# Altium schematic sheet Sheet1.SchDoc
size A1
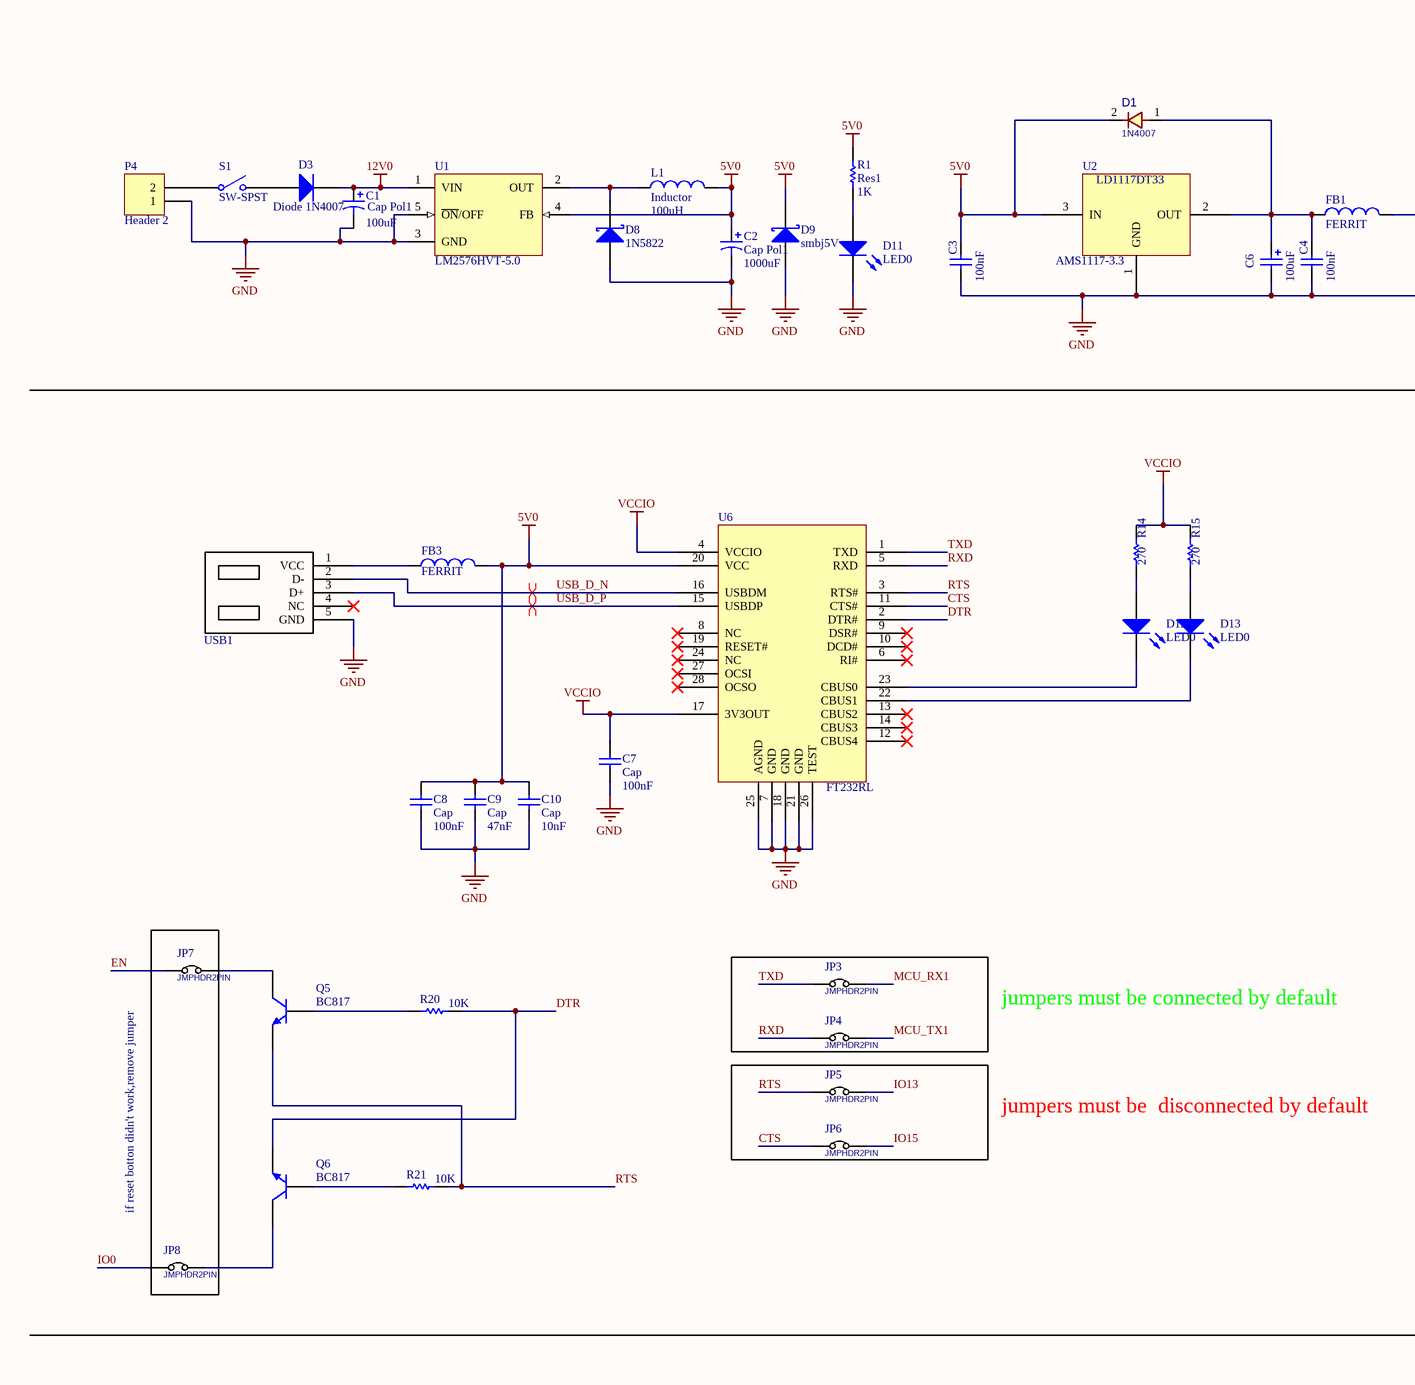
[diagram p0: Sheet1.SchDoc, top left]
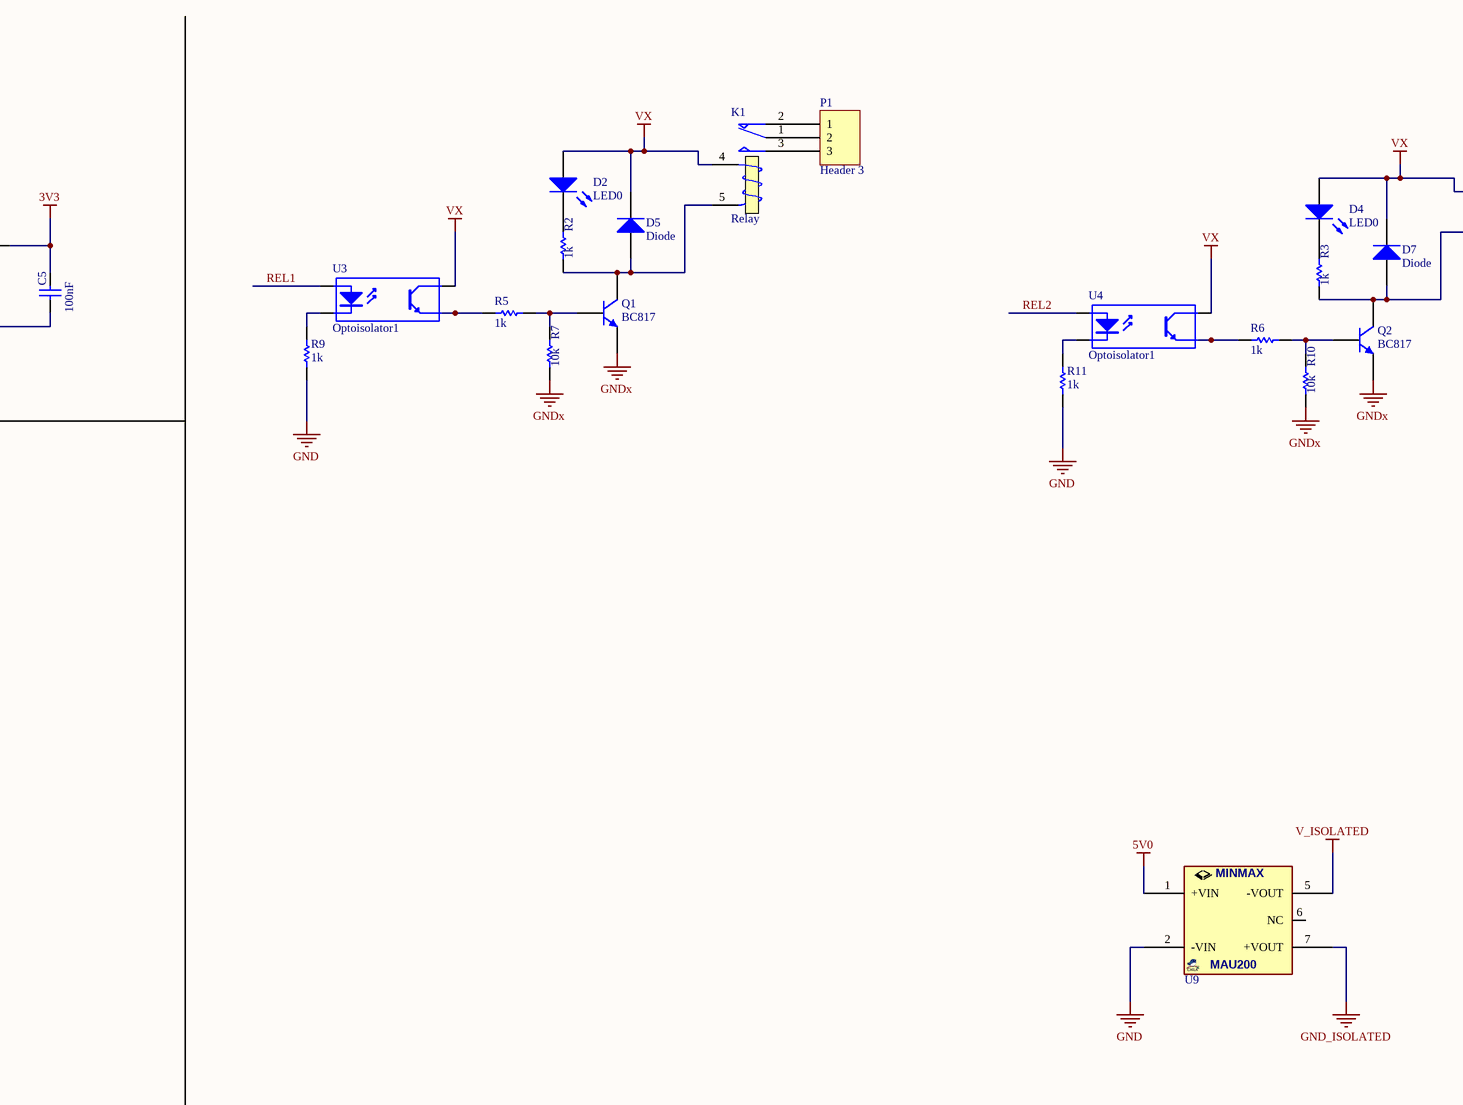
[diagram p1: Sheet1.SchDoc, top middle]
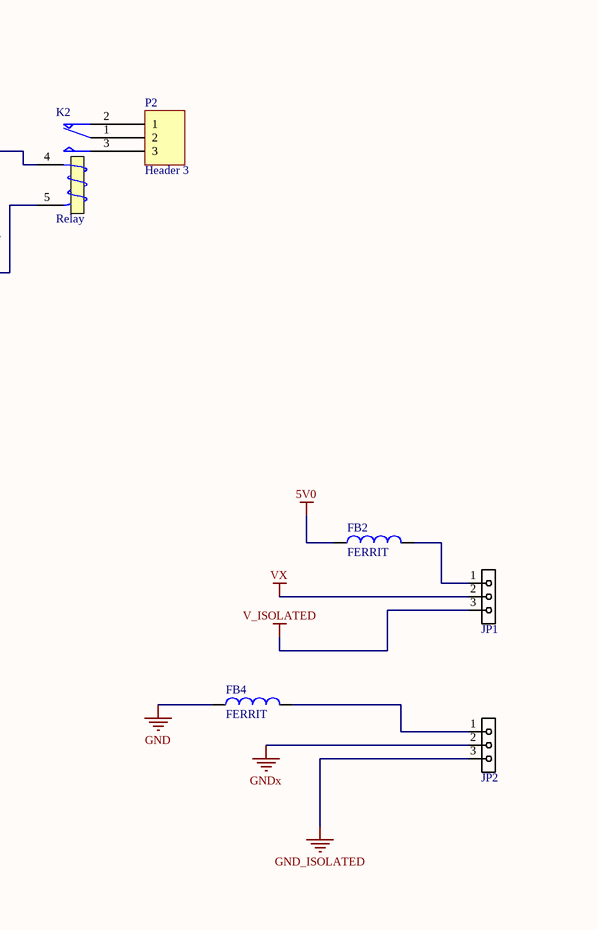
[diagram p2: Sheet1.SchDoc, top right]
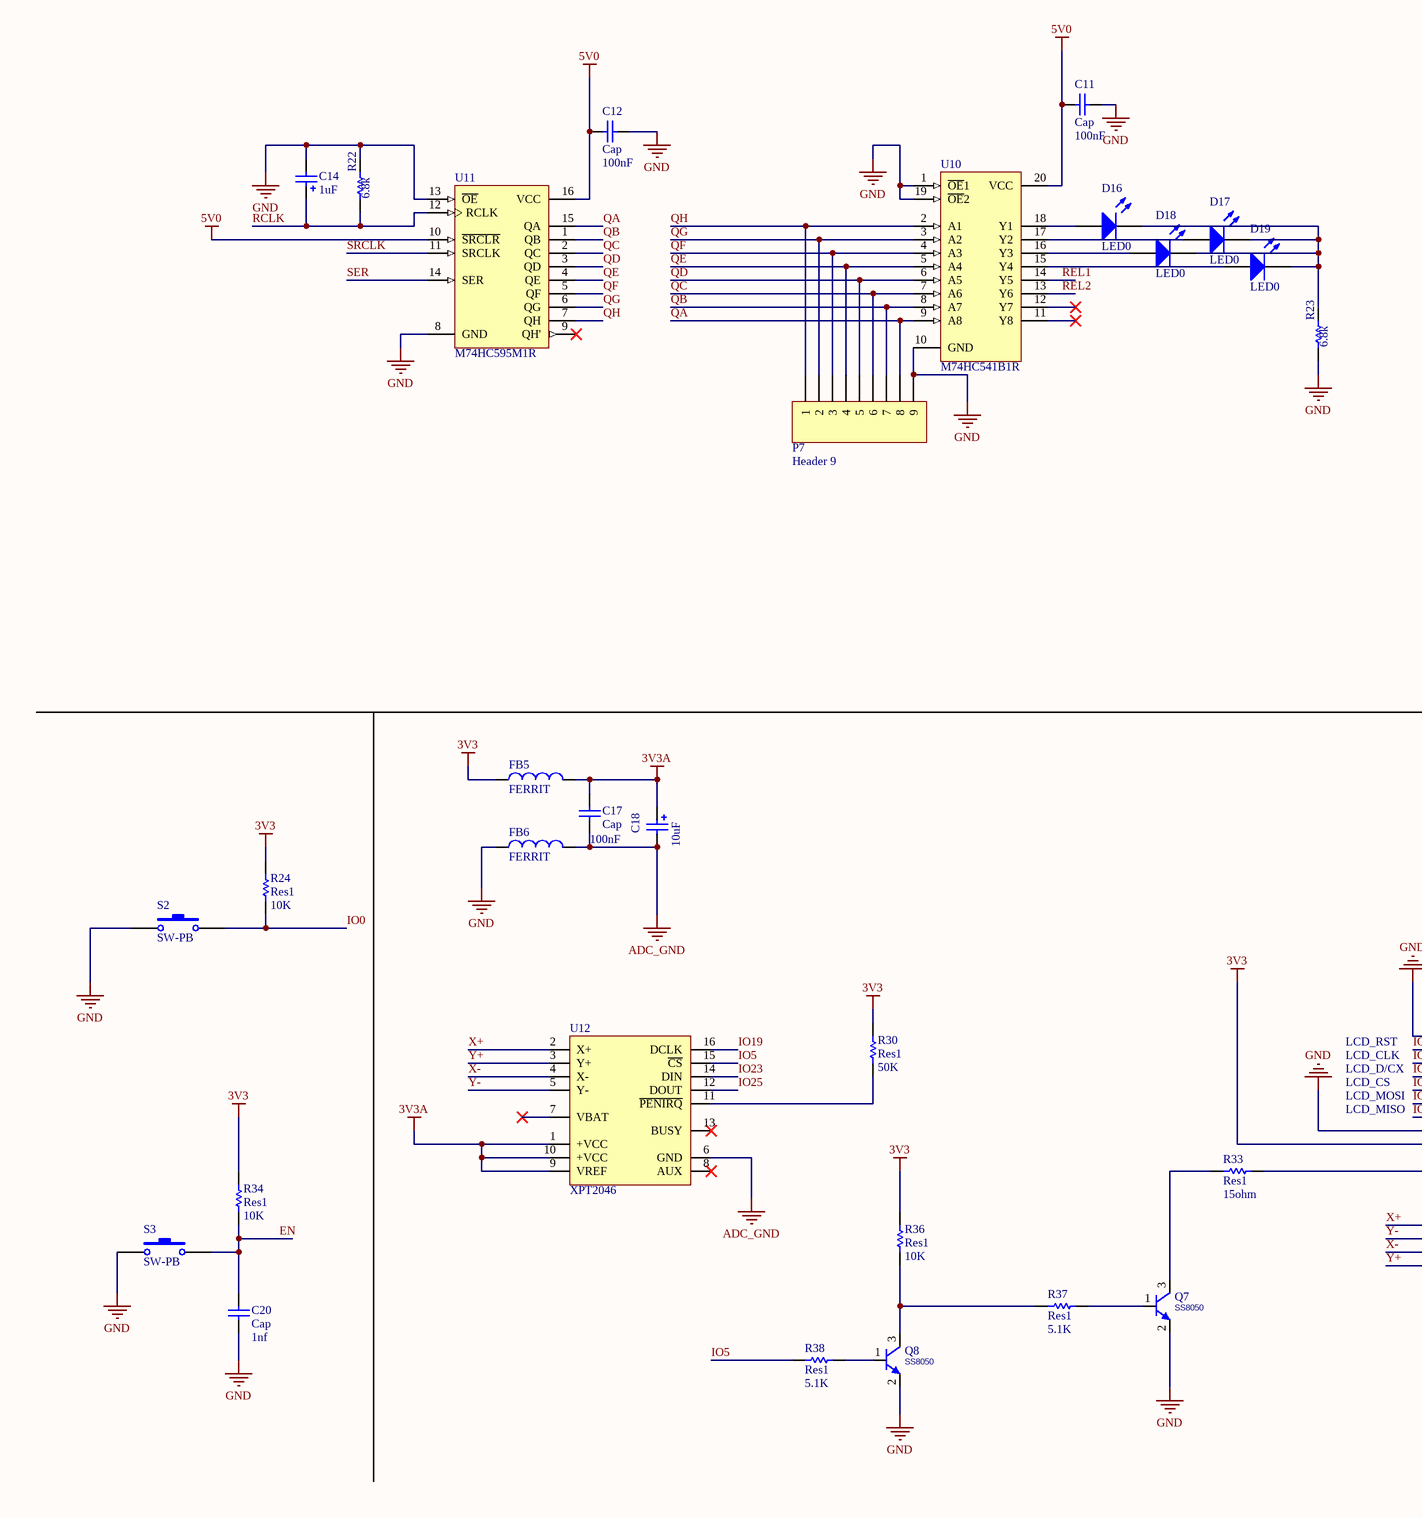
[diagram p3: Sheet1.SchDoc, bottom left]
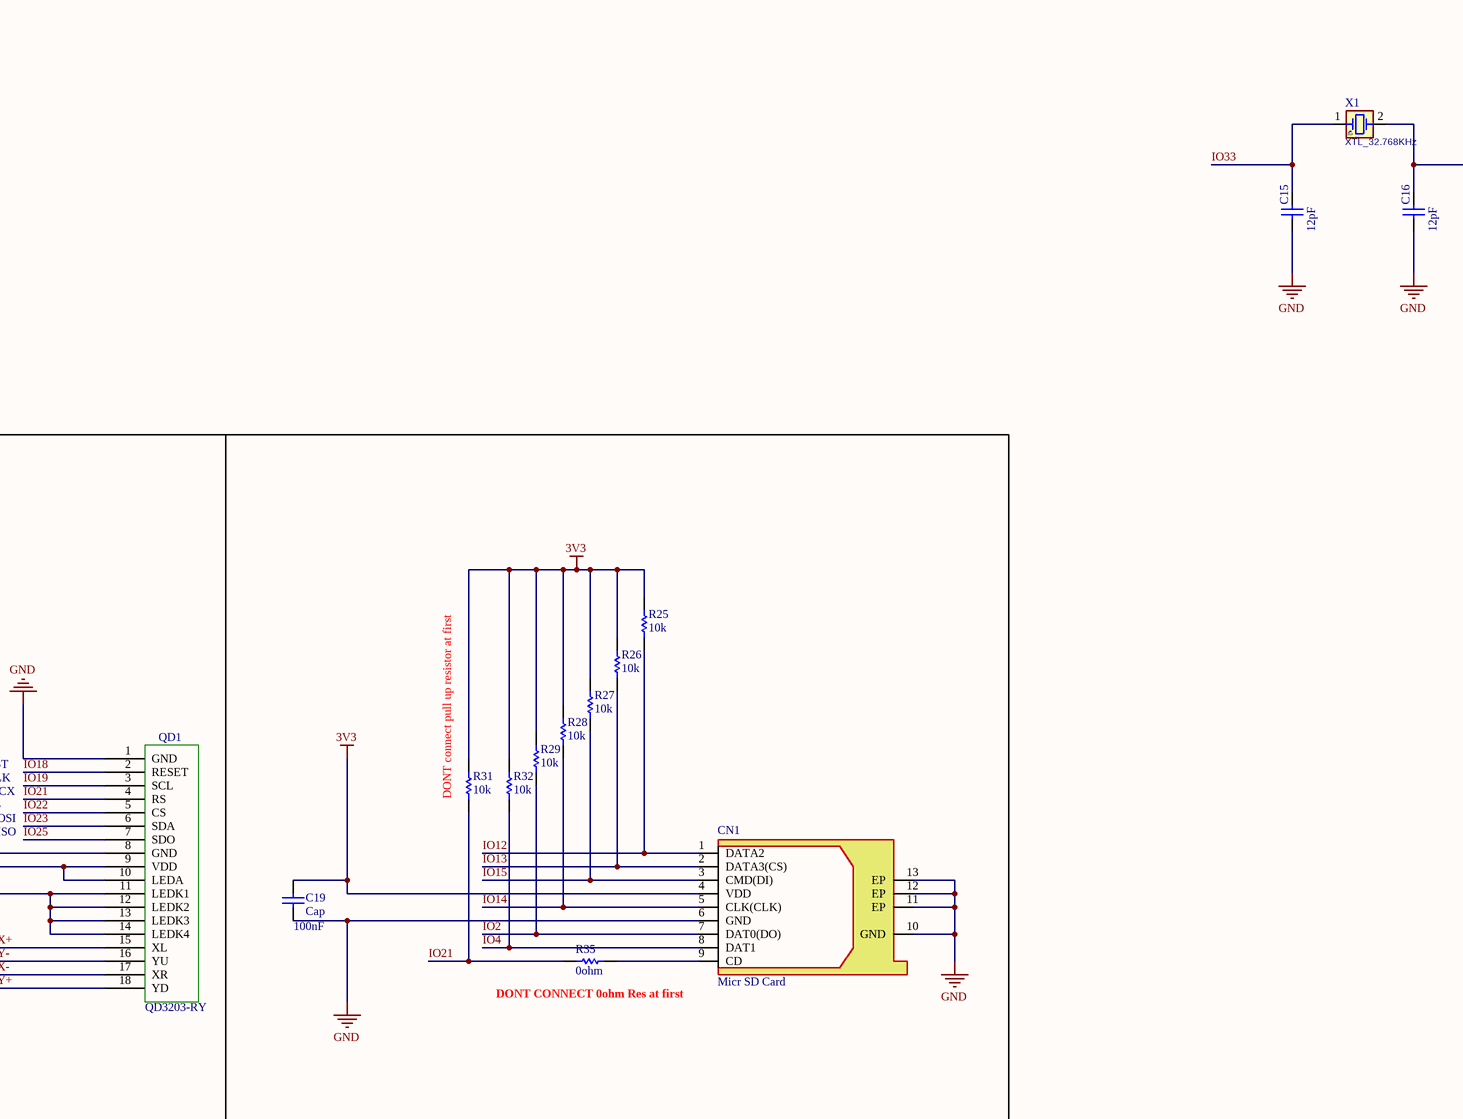
[diagram p4: Sheet1.SchDoc, bottom middle]
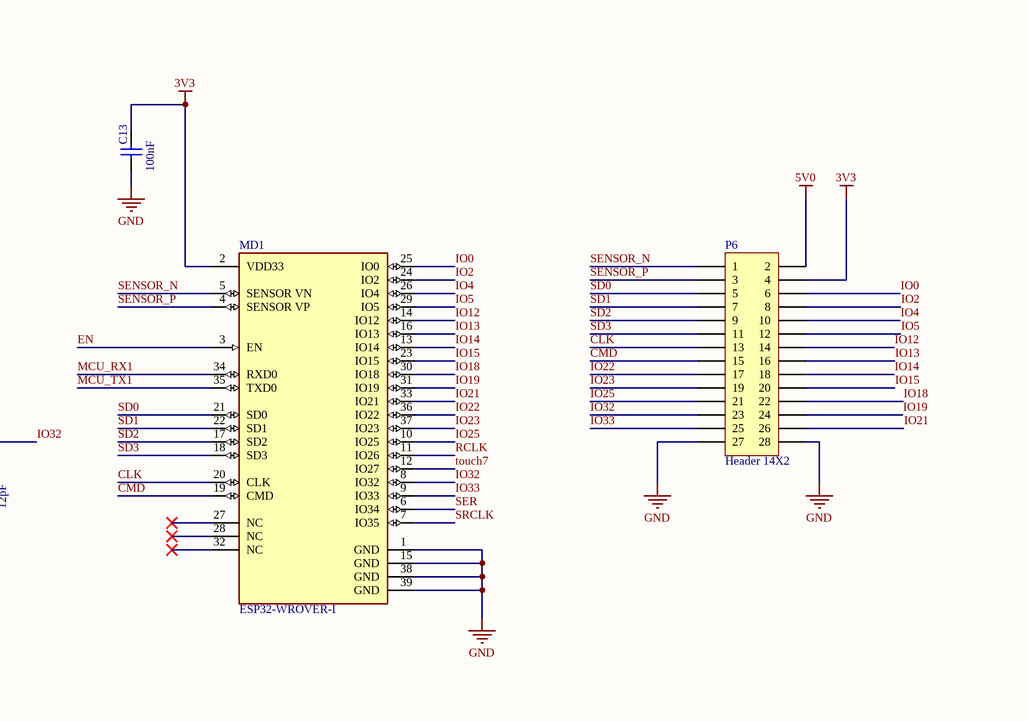
[diagram p5: Sheet1.SchDoc, bottom right]

## Parts
C1  Cap Pol1  value 100uF  [C_CYL_SMD2]
C2  Cap Pol1  value 1000uF  [C_CYL_SMD]
C3  value 100nF  [SMD_805]  (hidden comment: Cap)
C4  value 100nF  [SMD_805]  (hidden comment: Cap)
C5  value 100nF  [SMD_805]  (hidden comment: Cap)
C6  value 100uF  [C_B]  (hidden comment: Cap Pol2)
C7  Cap  value 100nF  [SMD_805]
C8  Cap  value 100nF  [SMD_805]
C9  Cap  value 47nF  [SMD_805]
C10  Cap  value 10nF  [SMD_805]
C11  Cap  value 100nF  [SMD_805]
C12  Cap  value 100nF  [SMD_805]
C13  value 100nF  [SMD_805]  (hidden comment: Cap)
C14  value 1uF  [CAP_SMD_A]  (hidden comment: Cap Pol2)
C15  value 12pF  [SMD_805]  (hidden comment: Cap)
C16  value 12pF  [SMD_805]  (hidden comment: Cap)
C17  Cap  value 100nF  [SMD_805]
C18  value 10uF  [C_B]  (hidden comment: Cap Pol2)
C19  Cap  value 100nF  [SMD_805]
C20  Cap  value 1nf  [SMD_805]
CN1  Micr SD Card  [Micro SD Card]
D1  1N4007  [D_SMA]
D2  LED0  [SMD_805]
D3  Diode 1N4007  [TVS]
D4  LED0  [SMD_805]
D5  Diode  [TVS]
D7  Diode  [TVS]
D8  1N5822  [DO_214_AB_SMC]
D9  smbj5V  [DO_214_AB_SMC]
D11  LED0  [SMD_805]
D12  LED0  [SMD_805]
D13  LED0  [SMD_805]
D16  LED0  [SMD_805]
D17  LED0  [SMD_805]
D18  LED0  [SMD_805]
D19  LED0  [SMD_805]
FB1  FERRIT  [SMD_805]
FB2  FERRIT  [SMD_805]
FB3  FERRIT  [SMD_805]
FB4  FERRIT  [SMD_805]
FB5  FERRIT  [SMD_805]
FB6  FERRIT  [SMD_805]
JP1  JMPHDR3PIN  [JP_3]  (value not drawn)
JP2  JMPHDR3PIN  [JP_3]  (value not drawn)
JP3  JMPHDR2PIN  [JP_2_BLK]
JP4  JMPHDR2PIN  [JP_2_BLK]
JP5  JMPHDR2PIN  [JP_2_BLK]
JP6  JMPHDR2PIN  [JP_2_BLK]
JP7  JMPHDR2PIN  [JP_2_BLK]
JP8  JMPHDR2PIN  [JP_2_BLK]
K1  Relay  [RELAY_5V]
K2  Relay  [RELAY_5V]
L1  Inductor  value 100uH  [INDUC_SMD]
MD1  ESP32-WROVER-I  [FP-ESP32-WROVER-I-MFG]
P1  Header 3  [PHOENIX_3]
P2  Header 3  [PHOENIX_3]
P4  Header 2  [adap_jack]
P6  Header 14X2  [HDR2X14]
P7  Header 9  [ARAY 9]
Q1  BC817  [SOT23]
Q2  BC817  [SOT23]
Q5  BC817  [SOT23]
Q6  BC817  [SOT23]
Q7  SS8050  [SOT23_3]
Q8  SS8050  [SOT23_3]
QD1  QD3203-RY  [QD-TFT2803]
R1  Res1  value 1K  [SMD_805]
R2  value 1k  [SMD_805]  (hidden comment: Res1)
R3  value 1k  [SMD_805]  (hidden comment: Res1)
R5  value 1k  [SMD_805]  (hidden comment: Res1)
R6  value 1k  [SMD_805]  (hidden comment: Res1)
R7  value 10k  [SMD_805]  (hidden comment: Res1)
R9  value 1k  [SMD_805]  (hidden comment: Res1)
R10  value 10k  [SMD_805]  (hidden comment: Res1)
R11  value 1k  [SMD_805]  (hidden comment: Res1)
R14  value 270  [SMD_805]  (hidden comment: Res1)
R15  value 270  [SMD_805]  (hidden comment: Res1)
R20  value 10K  [SMD_805]  (hidden comment: Res1)
R21  value 10K  [SMD_805]  (hidden comment: Res1)
R22  value 6.8k  [SMD_805]  (hidden comment: Res1)
R23  value 6.8k  [SMD_805]  (hidden comment: Res1)
R24  Res1  value 10K  [SMD_805]
R25  value 10k  [SMD_805]  (hidden comment: Res1)
R26  value 10k  [SMD_805]  (hidden comment: Res1)
R27  value 10k  [SMD_805]  (hidden comment: Res1)
R28  value 10k  [SMD_805]  (hidden comment: Res1)
R29  value 10k  [SMD_805]  (hidden comment: Res1)
R30  Res1  value 50K  [SMD_805]
R31  value 10k  [SMD_805]  (hidden comment: Res1)
R32  value 10k  [SMD_805]  (hidden comment: Res1)
R33  Res1  value 15ohm  [SMD_805]
R34  Res1  value 10K  [SMD_805]
R35  value 0ohm  [SMD_805]  (hidden comment: Res1)
R36  Res1  value 10K  [SMD_805]
R37  Res1  value 5.1K  [SMD_805]
R38  Res1  value 5.1K  [SMD_805]
S1  SW-SPST  [KEY1]
S2  SW-PB  [smd_button]
S3  SW-PB  [smd_button]
U1  LM2576HVT-5.0  [TO - 263]
U2  AMS1117-3.3  [SOT223]
U3  Optoisolator1  [PC817_SMD]
U4  Optoisolator1  [PC817_SMD]
U6  FT232RL  [SOG65_28_W]
U9  MAU202  [MINMAX_MAU200]  (value not drawn)
U10  M74HC541B1R  [SOP20]
U11  M74HC595M1R  [SO16_L]
U12  XPT2046  [TSSOP-16]
USB1  MICRO_USB  [MINI_USB]  (value not drawn)
X1  XTL_32.768KHz  [XTL_2_1610]

## Nets
3V3: C5.2 C13.2 C19.2 CN1.4(VDD) FB1.2 FB5.1 MD1.2(VDD33) P6.4 QD1.9(VDD) QD1.10(LEDA) R24.2 R25.1 R26.1 R27.1 R28.1 R29.1 R30.2 R31.1 R32.1 R34.2 R36.2
3V3A: C17.2 C18.1 FB5.2 U12.1(+VCC) U12.9(VREF) U12.10(+VCC)
5V0: C2.1 C3.2 C8.2 C9.2 C10.2 C11.2 C12.1 D1.2 D9.2(K) FB2.1 FB3.2 L1.2 P6.2 R1.2 U1.4(FB) U2.3(IN) U6.20(VCC) U9.1(+VIN) U10.20(VCC) U11.10(~{SRCLR}) U11.16(VCC)
12V0: C1.1 D3.2(K) U1.1(VIN)
ADC_GND: C17.1 C18.2 FB6.2 U12.6(GND)
GND: C1.2 C2.2 C3.1 C4.1 C5.1 C6.2 C7.1 C8.1 C9.1 C10.1 C11.1 C12.2 C13.1 C14.2 C15.1 C16.1 C19.1 C20.1 CN1.6(GND) CN1.10(GND) CN1.11(EP) CN1.12(EP) CN1.13(EP) D8.1(A) D9.1(A) D11.2(K) FB4.1 FB6.1 MD1.1(GND) MD1.15(GND) MD1.38(GND) MD1.39(GND) P4.1 P6.27 P6.28 P7.9 Q7.2(E) Q8.2(E) QD1.1(GND) QD1.8(GND) R9.2 R11.2 R22.2 R23.1 S2.1 S3.1 U1.3(GND) U1.5(~{ON}/OFF) U2.1(GND) U6.7(GND) U6.18(GND) U6.21(GND) U6.25(AGND) U6.26(TEST) U9.2(-VIN) U10.1(~{OE}1) U10.10(GND) U10.19(~{OE}2) U11.8(GND) U11.13(~{OE}) USB1.5(GND)
GND_ISOLATED: JP2.3 U9.7(+VOUT)
GNDx: JP2.2 Q1.2(E) Q2.2(E) R7.1 R10.1
V_ISOLATED: JP1.3 U9.5(-VOUT)
VCCIO: C7.2 R14.2 R15.2 U6.4(VCCIO) U6.17(3V3OUT)
VX: D2.1(A) D4.1(A) D5.2(K) D7.2(K) JP1.2 K1.4(T1) K2.4(T1) U3.4(C) U4.4(C)
CLK: MD1.20(CLK) P6.13
CMD: MD1.19(CMD) P6.15
CTS: JP6.1 U6.11(CTS#)
DTR: Q6.2(E) R20.1 U6.2(DTR#)
EN: C20.2 JP7.1 MD1.3(EN) R34.1 S3.2
IO0: JP8.1 MD1.25(IO0) P6.6 R24.1 S2.2
IO2: CN1.7(DAT0(DO)) MD1.24(IO2) P6.8 R29.2
IO4: CN1.8(DAT1) MD1.26(IO4) P6.10 R32.2
IO5: MD1.29(IO5) P6.12 R38.2 U12.15(~{CS})
IO12: CN1.1(DATA2) MD1.14(IO12) P6.14 R25.2
IO13: CN1.2(DATA3(CS)) JP5.2 MD1.16(IO13) P6.16 R26.2
IO14: CN1.5(CLK(CLK)) MD1.13(IO14) P6.18 R28.2
IO15: CN1.3(CMD(DI)) JP6.2 MD1.23(IO15) P6.20 R27.2
IO18: MD1.30(IO18) P6.22 QD1.2(RESET)
IO19: MD1.31(IO19) P6.24 QD1.3(SCL) U12.16(DCLK)
IO21: MD1.33(IO21) P6.26 QD1.4(RS) R31.2 R35.1
IO22: MD1.36(IO22) P6.17 QD1.5(CS)
IO23: MD1.37(IO23) P6.19 QD1.6(SDA) U12.14(DIN)
IO25: MD1.10(IO25) P6.21 QD1.7(SDO) U12.12(DOUT)
IO32: C16.2 MD1.8(IO32) P6.23 X1.2(OSC2)
IO33: C15.2 MD1.9(IO33) P6.25 X1.1(OSC1)
MCU_RX1: JP3.2 MD1.34(RXD0)
MCU_TX1: JP4.2 MD1.35(TXD0)
QA: P7.8 U10.9(A8) U11.15(QA)
QB: P7.7 U10.8(A7) U11.1(QB)
QC: P7.6 U10.7(A6) U11.2(QC)
QD: P7.5 U10.6(A5) U11.3(QD)
QE: P7.4 U10.5(A4) U11.4(QE)
QF: P7.3 U10.4(A3) U11.5(QF)
QG: P7.2 U10.3(A2) U11.6(QG)
QH: P7.1 U10.2(A1) U11.7(QH)
RCLK: C14.1 MD1.11(IO26) R22.1 U11.12(RCLK)
REL1: U3.1(A) U10.14(Y5)
REL2: U4.1(A) U10.13(Y6)
RTS: JP5.1 Q5.2(E) R21.1 U6.3(RTS#)
RXD: JP4.1 U6.5(RXD)
SD0: MD1.21(SD0) P6.5
SD1: MD1.22(SD1) P6.7
SD2: MD1.17(SD2) P6.9
SD3: MD1.18(SD3) P6.11
SENSOR_N: MD1.5(SENSOR_VN) P6.1
SENSOR_P: MD1.4(SENSOR_VP) P6.3
SER: MD1.6(IO34) U11.14(SER)
SRCLK: MD1.7(IO35) U11.11(SRCLK)
touch7: MD1.12(IO27)
TXD: JP3.1 U6.1(TXD)
USB_D_N: U6.16(USBDM) USB1.2(D-)
USB_D_P: U6.15(USBDP) USB1.3(D+)
X+: QD1.15(XL) U12.2(X+)
X-: QD1.17(XR) U12.4(X-)
Y+: QD1.18(YD) U12.3(Y+)
Y-: QD1.16(YU) U12.5(Y-)
NetC4_2: C4.2 C6.1 D1.1 FB1.1 U2.2(OUT)
NetCN1_9: CN1.9(CD) R35.2
NetD2_2: D2.2(K) R2.2
NetD3_1: D3.1(A) S1.2(NO)
NetD4_2: D4.2(K) R3.2
NetD5_1: D5.1(A) K1.5(T2) Q1.3(C) R2.1
NetD7_1: D7.1(A) K2.5(T2) Q2.3(C) R3.1
NetD8_2: D8.2(K) L1.1 U1.2(OUT)
NetD11_1: D11.1(A) R1.1
NetD12_1: D12.1(A) R14.1
NetD12_2: D12.2(K) U6.23(CBUS0)
NetD13_1: D13.1(A) R15.1
NetD13_2: D13.2(K) U6.22(CBUS1)
NetD16_1: D16.1(A) U10.18(Y1)
NetD16_2: D16.2(K) D17.2(K) D18.2(K) D19.2(K) R23.2
NetD17_1: D17.1(A) U10.17(Y2)
NetD18_1: D18.1(A) U10.16(Y3)
NetD19_1: D19.1(A) U10.15(Y4)
NetFB2_2: FB2.2 JP1.1
NetFB3_1: FB3.1 USB1.1(VCC)
NetFB4_2: FB4.2 JP2.1
NetJP7_2: JP7.2 Q5.3(C)
NetJP8_2: JP8.2 Q6.3(C)
NetK1_1: K1.1(COM) P1.2
NetK1_2: K1.2(NC) P1.1
NetK1_3: K1.3(NO) P1.3
NetK2_1: K2.1(COM) P2.2
NetK2_2: K2.2(NC) P2.1
NetK2_3: K2.3(NO) P2.3
NetP4_2: P4.2 S1.1(COMMON)
NetQ1_1: Q1.1(B) R5.2 R7.2
NetQ2_1: Q2.1(B) R6.2 R10.2
NetQ5_1: Q5.1(B) R20.2
NetQ6_1: Q6.1(B) R21.2
NetQ7_1: Q7.1(B) R37.1
NetQ7_3: Q7.3(C) R33.2
NetQ8_1: Q8.1(B) R38.1
NetQ8_3: Q8.3(C) R36.1 R37.2
NetQD1_11: QD1.11(LEDK1) QD1.12(LEDK2) QD1.13(LEDK3) QD1.14(LEDK4) R33.1
NetR5_1: R5.1 U3.3(E)
NetR6_1: R6.1 U4.3(E)
NetR9_1: R9.1 U3.2(K)
NetR11_1: R11.1 U4.2(K)
NetR30_1: R30.1 U12.11(~{PENIRQ})

Not connected (* = marked no-connect by the designer): MD1 27(NC)* 28(NC)* 32(NC)*; U6 6(RI#)* 8(NC)* 9(DSR#)* 10(DCD#)* 12(CBUS4)* 13(CBUS2)* 14(CBUS3)* 19(RESET#)* 24(NC)* 27(OCSI)* 28(OCSO)*; U9 6(NC); U10 11(Y8)* 12(Y7)*; U11 9(QH')*; U12 7(VBAT)* 8(AUX)* 13(BUSY)*; USB1 4(NC)*

## Layout directives
differential pair: USB_D_N, USB_D_P

## Notes on the sheet
- jumpers must be connected by default
- jumpers must be  disconnected by default
- if reset botton didn't work,remove jumper
- LCD_RST
- LCD_CLK
- LCD_D/CX
- (near R31) DONT connect pull up resistor at first
- LCD_CS
- LCD_MOSI
- LCD_MISO
- (near R35) DONT CONNECT 0ohm Res at first
- Title
- Size:
- Date:
- File:
- A1
- Number:
- Time:
- Revision:
- Sheet
- of
- (in symbol MAU202) MAU200

## Library data of the parts
C1 C2 = Cap Pol1: Polarized Capacitor (Radial); Published: 8-Jun-2000; LatestRevisionDate: 17-Jul-2002; LatestRevisionNote: Re-released for DXP Platform.; PackageReference: RB7.6-15; Publisher: Altium Limited
C3-C5 C7-C13 C15-C17 C19 C20 = Cap: Capacitor; Published: 8-Jun-2000; LatestRevisionDate: 17-Jul-2002; LatestRevisionNote: Re-released for DXP Platform.; PackageReference: RAD-0.3; Publisher: Altium Limited
C6 C14 C18 = Cap Pol2: Polarized Capacitor (Axial); Published: 8-Jun-2000; LatestRevisionDate: 17-Jul-2002; LatestRevisionNote: Re-released for DXP Platform.; PackageReference: POLAR0.8; Publisher: Altium Limited
CN1 = Micro SD Card
D1 = DIODE_SMD_1N4007: DIODE, GENERAL PURPOSE, 1000V/1A; MANF: Kingtronics; DESC: DESCRIPTION; PARAM: 1000V VRRM; PARAM2: 1A; MANF_P#: M7; ASSEMBLY: ASSEMBLY; PRICE: PRICE; VALUE: 1N4007
D2 D4 D11-D13 D16-D19 = LED0: Typical INFRARED GaAs LED; Published: 8-Jun-2000; LatestRevisionDate: 08-Jul-2005; LatestRevisionNote: Mech Layer 1 removed.; PackageReference: LED-0; Publisher: Altium Limited
D3 = Diode 1N4007: 1 Amp General Purpose Rectifier; Published: 8-Jun-2000; LatestRevisionDate: 17-Jul-2002; LatestRevisionNote: Re-released for DXP Platform.; DatasheetVersion: 1998; PackageVersion: Aug-1999; PackageReference: DO-41; Publisher: Altium Limited; Code_JEDEC: DO-204-AL; ComponentLink1Description: Manufacturer Link; ComponentLink1URL: http://www.fairchildsemi.com/; ComponentLink2Description: Datasheet; ComponentLink2URL: http://www.fairchildsemi.com/ds/1N%2F1N4001.pdf
D5 D7 = Diode: Default Diode; Published: 8-Jun-2000; LatestRevisionDate: 17-Jul-2002; LatestRevisionNote: Re-released for DXP Platform.; PackageVersion: Sep-1996; PackageReference: SMC; Publisher: Altium Limited; Code_JEDEC: DO-214-AB
D8 D9 = Diode 11DQ03: Schottky Rectifier; Published: 8-Jun-2000; LatestRevisionDate: 17-Jul-2002; LatestRevisionNote: Re-released for DXP Platform.; DatasheetVersion: Dec-1997; PackageReference: DO-204AL; Publisher: Altium Limited; Code_JEDEC: DO-204-AL; ComponentLink1Description: Manufacturer Link; ComponentLink1URL: http://www.irf.com/; ComponentLink2Description: Datasheet; ComponentLink2URL: http://www.irf.com/product-info/datasheets/data/11dq03.pdf
FB1-FB6 L1 = Inductor: Code_IEC: 1005; Published: 8-Jun-2000; LatestRevisionDate: 29-May-2009; LatestRevisionNote: IPC-7351 Footprint Added.; PackageReference: 0402-A; Publisher: Altium Limited; PackageDescription: Chip Inductor; Code_JEITA: 0402
JP1 JP2 = JUMPER_HDR_3P: JUMPER, HEADER 3PIN; MANF: MANF; MANF_P#: MANF_P#; VALUE: JMPHDR3PIN
JP3-JP8 = JUMPER_HDR_2P: JUMPER, HEADER 2PIN; MANF: MANF; MANF_P#: MANF_P#; VALUE: JMPHDR2PIN
K1 K2 = Relay: SPDT Relay; Published: 8-Jun-2000; LatestRevisionDate: 17-Jul-2002; LatestRevisionNote: Re-released for DXP Platform.; PackageReference: MODULE5B; Publisher: Altium Limited
MD1 = CMP-194065-000001-1: SMD MODULE, ESP32-D0WDQ6, 32MBIT; Manufacturer: Espressif; Number Of Adc Channels: 16; Min Supply Voltage: 2.3V; Interface: I2C,SPI,UART,I2S,Other; Max Frequency: 2484MHz; Nominal Supply Current: 500mA; Sensitivity: -98dBm; Max Supply Voltage: 3.6V; Number Of Gpio: 20; Data Rate: 150Mbits/s; Package: ESP32-WROVER-I; Temperature Range Low: -40°C; Temperature Range High: +85°C; Device Class L1: Integrated Circuits (ICs); Category: UNK; ComponentLink2Description: Datasheet; Device Class L2: RF Semiconductors and Devices; Automotive: No; Lead Free: Yes; Octopart: https://octopart.com/esp32-wrover-i-espressif+systems-89171349; ComponentLink2URL: https://www.espressif.com/sites/default/files/documentation/esp32-wrover_datasheet_en.pdf; Temperature: -40°C to +85°C; Height: 3.4mm; RoHS: TRUE; Digikey Description: SMD MODULE, ESP32-D0WDQ6, 32MBIT; Device Class L3: Transceivers; Manufacturer Part Number: ESP32-WROVER-I
P1 P2 = Header 3: Header, 3-Pin; LatestRevisionDate: 17-Jul-2002; LatestRevisionNote: Re-released for DXP Platform.; Publisher: Altium Limited
P4 = Header 2: Header, 2-Pin; LatestRevisionDate: 17-Jul-2002; LatestRevisionNote: Re-released for DXP Platform.; Publisher: Altium Limited
P6 = Header 14X2: Header, 14-Pin, Dual row; LatestRevisionDate: 17-Jul-2002; LatestRevisionNote: Re-released for DXP Platform.; Publisher: Altium Limited
P7 = Header 9: Header, 9-Pin; LatestRevisionDate: 17-Jul-2002; LatestRevisionNote: Re-released for DXP Platform.; Publisher: Altium Limited
Q1 Q2 Q5 Q6 = 2N3904: NPN General Purpose Amplifier; Published: 8-Jun-2000; LatestRevisionDate: 15-Jan-2003; LatestRevisionNote: PCB Footprint 'BCY-W3/D4.7' replaced; DatasheetVersion: 1997; PackageVersion: Sep-1998; PackageReference: TO-92A; Publisher: Altium Limited; Code_JEDEC: TO-92A; ComponentLink1Description: Manufacturer Link; ComponentLink1URL: http://www.fairchildsemi.com/; ComponentLink2Description: Datasheet; ComponentLink2URL: http://www.fairchildsemi.com/ds/2N%2F2N3904.pdf
Q7 Q8 = NPN_SS8050_SOT23: BJT, NPN, 25v, 1.5A, SMD, SOT23; PARAM2: 300mW; MANF: GALAXY; PARAM: 25v, 1.5A; MANF_P#: SS8050; VALUE: SS8050
QD1 = FPC240A8230-V1-E
R1-R3 R5-R7 R9-R11 R14 R15 R20-R38 = Res1: Resistor; Published: 8-Jun-2000; LatestRevisionDate: 17-Jul-2002; LatestRevisionNote: Re-released for DXP Platform.; PackageReference: AXIAL-0.3; Publisher: Altium Limited
S1 = SW-SPST: Single-Pole, Single-Throw Switch; Published: 24-Mar-1999; LatestRevisionDate: 17-Jul-2002; LatestRevisionNote: Re-released for DXP Platform.; PackageReference: SPST-2; Publisher: Altium Limited
S2 S3 = SW-PB: Switch; Published: 24-Mar-1999; LatestRevisionDate: 17-Jul-2002; LatestRevisionNote: Re-released for DXP Platform.; PackageReference: SPST-2; Publisher: Altium Limited
U1 = LM2576HVT-5.0: SIMPLE SWITCHER; 3A Step-Down Voltage Regulator; Manufacturer: National Semiconductor; PackageTopMarking: NSUZXYTT*LM2576HVT*-5.0 P+; PowerWise: N; Published: 4-Dec-2008; DatasheetVersion: Aug-2004; PackageVersion: revJ, Jan-1992; PackageReference: T05A; Publisher: Altium Limited; PackageDescription: TO-220, Molded, 5 Lead, Straight; CompType: Switcher; PartNumber: LM2576HVT-5.0; RoHS: O; PinCount: 5; DigiKeyPartNumber: LM2576HVT-5.0-ND; Code_JEDEC: TO-220-AB; ComponentLink1Description: LM2576HV Datasheet; ComponentLink1URL: http://www.national.com/ds/LM/LM2576HV.pdf; ComponentLink2Description: LM2576HV Web Page; ComponentLink2URL: http://www.national.com/pf/LM/LM2576HV.html; ComponentLink3Description: T05A Package Page; ComponentLink3URL: http://www.national.com/packaging/folders/t05a.html
U2 = LD1117DT33
U3 U4 = Optoisolator1: 4-Pin Phototransistor Optocoupler; Published: 24-Mar-1999; LatestRevisionDate: 04-Mar-2005; LatestRevisionNote: Sch pins 3 & 4 Swapped.; DatasheetVersion: Nov-2003; PackageReference: DIP-4; Publisher: Altium Limited
U9 = MAU202: DC-DC Converter, Isolated, 1W; MANF: MINMAX; PARAM2: 4.5~5.5(5)Vin, 5Vout, 1W; PARAM: 200mA, -40~85°C; DESC: https://www.minmax.com.tw/cn/download/files/228/MAU200_Datasheet.pdf; MANF_P#: MAU202; VALUE: MAU202
U10 = M74HC541B1R: Octal Bus Buffer with 3 State Outputs (Non Inverted); Published: 8-Jun-2000; LatestRevisionDate: 06-Jun-2005; LatestRevisionNote: Stylized 3D Model Added.; DatasheetVersion: Oct-1993; PackageVersion: Jun-1998; PackageReference: DIP20; Publisher: Altium Limited; PackageDescription: DIP; 20 Leads; Row Spacing 7.62 mm; Pitch 2.54 mm; Code_JEDEC: MS-015-AE; ComponentLink1Description: Manufacturer Link; ComponentLink1URL: http://www.st.com/
U11 = M74HC595M1R: 8 Bit Shift Register with Output Latches (3 STATE); Published: 8-Jun-2000; LatestRevisionDate: 13-Apr-2006; LatestRevisionNote: IPC-7351 Footprint Added.; DatasheetVersion: Apr-1993; PackageVersion: May-1998; PackageReference: SO16; Publisher: Altium Limited; PackageDescription: 16-Pin Small Outline Integrated Circuit 1.27 mm Pitch; Code_IPC: SOIC127P600-16; ComponentLink1Description: Manufacturer Link; ComponentLink1URL: http://www.st.com/; ComponentLink2Description: Datasheet; ComponentLink2URL: http://www.st.com/stonline/products/literature/ds/1989/m74hc595.pdf
X1 = XTL_2_32.768_1610A: Crystal, 32.768KHz, 9pF, 20PPM; MANF: ABRACON; MANF_P#: ABS05-32.768KHZ-9-T; PARAM: -40~85oC; PARAM2: 9pF, 20PPM; PRICE: 0.8$; VALUE: XTL_32.768KHz